# Altium project PCB_Project.PrjPcb
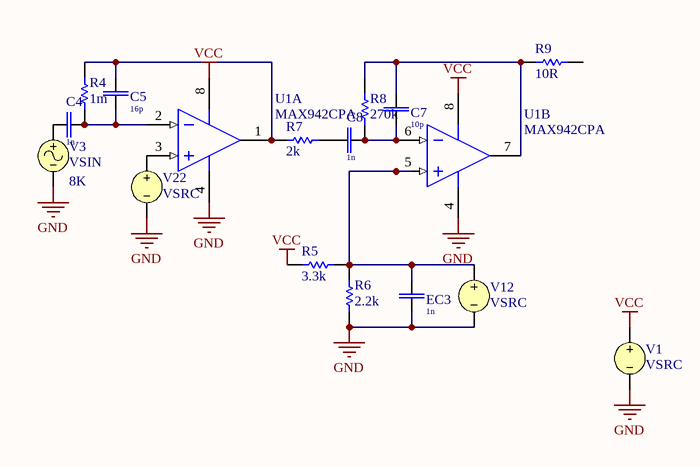
[diagram p0: Max942.SchDoc]
1 sheet, 16 parts. Net scope: global (net labels, ports and power ports of the same name join across sheets).

## Sheet Max942.SchDoc
size A4

### Parts
C4  value 1n  (hidden comment: Cap)
C5  value 16p  (hidden comment: Cap)
C7  value 10p  (hidden comment: Cap)
C8  value 1n  (hidden comment: Cap)
EC3  value 1n  (hidden comment: Cap)
R4  value 1m  [AXIAL-0.5]  (hidden comment: Res Semi)
R5  value 3.3k  [AXIAL-0.5]  (hidden comment: Res Semi)
R6  value 2.2k  [AXIAL-0.5]  (hidden comment: Res Semi)
R7  value 2k  [AXIAL-0.5]  (hidden comment: Res Semi)
R8  value 270k  [AXIAL-0.5]  (hidden comment: Res Semi)
R9  value 10R  [AXIAL-0.5]  (hidden comment: Res Semi)
U1  MAX942CPA  [PA8]  (parts A,B of 2)
V1  VSRC
V3  VSIN  Frequency: 8K
V12  VSRC
V22  VSRC

### Nets
GND: EC3.2 R6.2 U1.4(GND) V1.2 V3.2 V12.2 V22.2
VCC: R5.1 U1.8(V+) V1.1
NetC4_1: C4.1 V3.1
NetC4_2: C4.2 C5.1 R4.1 U1.2(IN-)
NetC5_2: C5.2 R4.2 R7.2 U1.1(OUT)
NetC7_1: C7.1 R8.1 R9.2 U1.7(OUT)
NetC7_2: C7.2 C8.1 R8.2 U1.6(IN-)
NetC8_2: C8.2 R7.1
NetEC3_1: EC3.1 R5.2 R6.1 U1.5(IN+) V12.1
NetU1_3: U1.3(IN+) V22.1

Not connected (* = marked no-connect by the designer): R9 1

### Library data of the parts
C4 C5 C7 C8 EC3 = Cap: Capacitor; Published: 8-Jun-2000; LatestRevisionDate: 17-Jul-2002; LatestRevisionNote: Re-released for DXP Platform.; PackageReference: RAD-0.3; Publisher: Altium Limited
R4-R9 = Res Semi: Semiconductor Resistor; Published: 8-Jun-2000; LatestRevisionDate: 17-Jul-2002; LatestRevisionNote: Re-released for DXP Platform.; PackageReference: AXIAL-0.5; Publisher: Altium Limited
U1 = MAX942CPA: High-speed, Low-power, 3V/5V, Rail-to-Rail Dual-Supply Comparator; Published: 16-Jan-2001; LatestRevisionDate: 29-May-2009; LatestRevisionNote: Component Body Added.; DatasheetVersion: Jun-1997; PackageVersion: RevB, 21-0043; PackageReference: PA8; Publisher: Altium Limited; PackageDescription: DIP, 8-Pin, Row Spacing 7.62 mm, Pitch 2.54 mm; Code_JEDEC: MS-001-AB; ComponentLink1Description: Manufacturer Link; ComponentLink1URL: http://www.maxim-ic.com/; ComponentLink2Description: Datasheet; ComponentLink2URL: http://pdfserv.maxim-ic.com/en/ds/MAX941-MAX944.pdf
V1 = VSRC: Voltage Source; Note: PCB Footprint - Not required; Value: 5V; Published: 8-Jun-2000; LatestRevisionDate: 17-Jul-2002; LatestRevisionNote: Re-released for DXP Platform.; PackageReference: Not Applicable; Publisher: Altium Limited
V3 = VSIN: Sinusoidal Voltage Source; Note: PCB Footprint - Not required; Published: 8-Jun-2000; LatestRevisionDate: 15-Nov-2004; LatestRevisionNote: Corrected Netlist.; PackageReference: Not Applicable; Publisher: Altium Limited
V12 V22 = VSRC: Voltage Source; Note: PCB Footprint - Not required; Value: 2.5V; Published: 8-Jun-2000; LatestRevisionDate: 17-Jul-2002; LatestRevisionNote: Re-released for DXP Platform.; PackageReference: Not Applicable; Publisher: Altium Limited